# Altium schematic sheet FPGABank1X.SchDoc
size A4; SheetNumber: 6; SheetTotal: 10
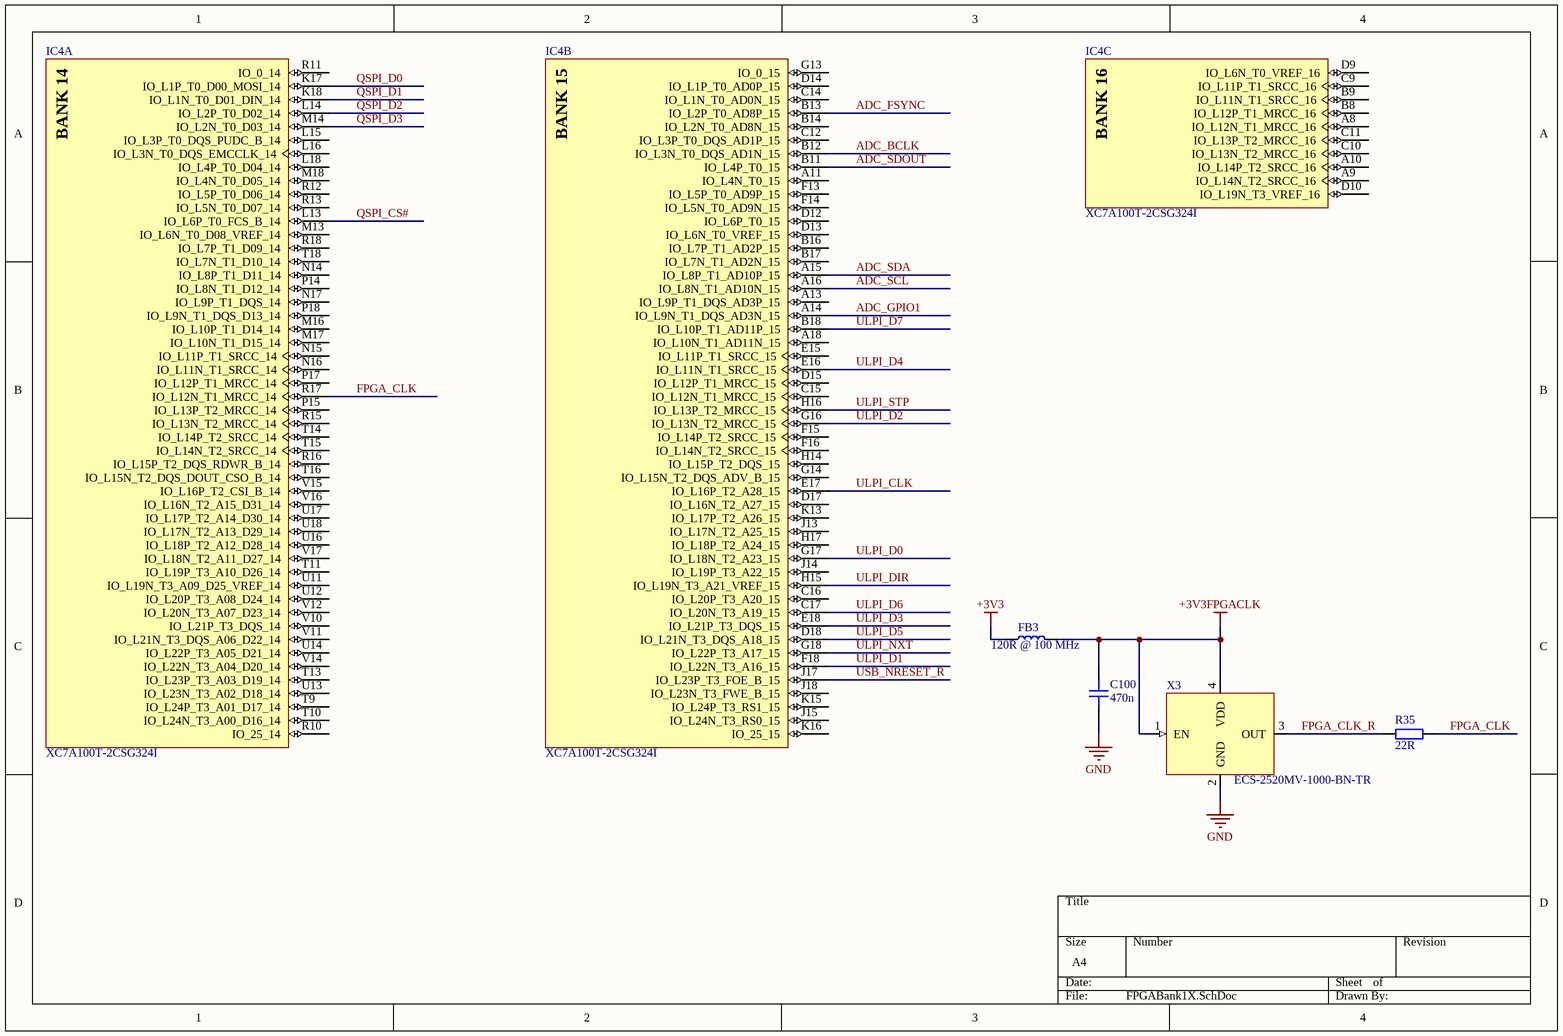
[diagram p0: FPGABank1X.SchDoc]

## Parts
C100  470n  [CAP_0201]
FB3  120R @ 100 MHz  [IND_0201]
IC4  XC7A100T-2CSG324I  [CSG324]  (parts A,B,C of 9)
R35  22R  [RES_0201]
X3  ECS-2520MV-1000-BN-TR  [XTAL_2520]

## Nets
+3V3: FB3.1
+3V3FPGACLK: C100.2 FB3.2 X3.1(EN) X3.4(VDD)
GND: C100.1 X3.2(GND)
ADC_BCLK: IC4.B12(IO_L3N_T0_DQS_AD1N_15)
ADC_FSYNC: IC4.B13(IO_L2P_T0_AD8P_15)
ADC_GPIO1: IC4.A14(IO_L9N_T1_DQS_AD3N_15)
ADC_SCL: IC4.A16(IO_L8N_T1_AD10N_15)
ADC_SDA: IC4.A15(IO_L8P_T1_AD10P_15)
ADC_SDOUT: IC4.B11(IO_L4P_T0_15)
FPGA_CLK: IC4.R17(IO_L12N_T1_MRCC_14) R35.2
FPGA_CLK_R: R35.1 X3.3(OUT)
QSPI_CS#: IC4.L13(IO_L6P_T0_FCS_B_14)
QSPI_D0: IC4.K17(IO_L1P_T0_D00_MOSI_14)
QSPI_D1: IC4.K18(IO_L1N_T0_D01_DIN_14)
QSPI_D2: IC4.L14(IO_L2P_T0_D02_14)
QSPI_D3: IC4.M14(IO_L2N_T0_D03_14)
ULPI_CLK: IC4.E17(IO_L16P_T2_A28_15)
ULPI_D0: IC4.G17(IO_L18N_T2_A23_15)
ULPI_D1: IC4.F18(IO_L22N_T3_A16_15)
ULPI_D2: IC4.G16(IO_L13N_T2_MRCC_15)
ULPI_D3: IC4.E18(IO_L21P_T3_DQS_15)
ULPI_D4: IC4.E16(IO_L11N_T1_SRCC_15)
ULPI_D5: IC4.D18(IO_L21N_T3_DQS_A18_15)
ULPI_D6: IC4.C17(IO_L20N_T3_A19_15)
ULPI_D7: IC4.B18(IO_L10P_T1_AD11P_15)
ULPI_DIR: IC4.H15(IO_L19N_T3_A21_VREF_15)
ULPI_NXT: IC4.G18(IO_L22P_T3_A17_15)
ULPI_STP: IC4.H16(IO_L13P_T2_MRCC_15)
USB_NRESET_R: IC4.J17(IO_L23P_T3_FOE_B_15)

Not connected (* = marked no-connect by the designer): IC4 A8(IO_L12N_T1_MRCC_16) A9(IO_L14N_T2_SRCC_16) A10(IO_L14P_T2_SRCC_16) A11(IO_L4N_T0_15) A13(IO_L9P_T1_DQS_AD3P_15) A18(IO_L10N_T1_AD11N_15) B8(IO_L12P_T1_MRCC_16) B9(IO_L11N_T1_SRCC_16) B14(IO_L2N_T0_AD8N_15) B16(IO_L7P_T1_AD2P_15) B17(IO_L7N_T1_AD2N_15) C9(IO_L11P_T1_SRCC_16) C10(IO_L13N_T2_MRCC_16) C11(IO_L13P_T2_MRCC_16) C12(IO_L3P_T0_DQS_AD1P_15) C14(IO_L1N_T0_AD0N_15) C15(IO_L12N_T1_MRCC_15) C16(IO_L20P_T3_A20_15) D9(IO_L6N_T0_VREF_16) D10(IO_L19N_T3_VREF_16) D12(IO_L6P_T0_15) D13(IO_L6N_T0_VREF_15) D14(IO_L1P_T0_AD0P_15) D15(IO_L12P_T1_MRCC_15) D17(IO_L16N_T2_A27_15) E15(IO_L11P_T1_SRCC_15) F13(IO_L5P_T0_AD9P_15) F14(IO_L5N_T0_AD9N_15) F15(IO_L14P_T2_SRCC_15) F16(IO_L14N_T2_SRCC_15) G13(IO_0_15) G14(IO_L15N_T2_DQS_ADV_B_15) H14(IO_L15P_T2_DQS_15) H17(IO_L18P_T2_A24_15) J13(IO_L17N_T2_A25_15) J14(IO_L19P_T3_A22_15) J15(IO_L24N_T3_RS0_15) J18(IO_L23N_T3_FWE_B_15) K13(IO_L17P_T2_A26_15) K15(IO_L24P_T3_RS1_15) K16(IO_25_15) L15(IO_L3P_T0_DQS_PUDC_B_14) L16(IO_L3N_T0_DQS_EMCCLK_14) L18(IO_L4P_T0_D04_14) M13(IO_L6N_T0_D08_VREF_14) M16(IO_L10P_T1_D14_14) M17(IO_L10N_T1_D15_14) M18(IO_L4N_T0_D05_14) N14(IO_L8P_T1_D11_14) N15(IO_L11P_T1_SRCC_14) N16(IO_L11N_T1_SRCC_14) N17(IO_L9P_T1_DQS_14) P14(IO_L8N_T1_D12_14) P15(IO_L13P_T2_MRCC_14) P17(IO_L12P_T1_MRCC_14) P18(IO_L9N_T1_DQS_D13_14) R10(IO_25_14) R11(IO_0_14) R12(IO_L5P_T0_D06_14) R13(IO_L5N_T0_D07_14) R15(IO_L13N_T2_MRCC_14) R16(IO_L15P_T2_DQS_RDWR_B_14) R18(IO_L7P_T1_D09_14) T9(IO_L24P_T3_A01_D17_14) T10(IO_L24N_T3_A00_D16_14) T11(IO_L19P_T3_A10_D26_14) T13(IO_L23P_T3_A03_D19_14) T14(IO_L14P_T2_SRCC_14) T15(IO_L14N_T2_SRCC_14) T16(IO_L15N_T2_DQS_DOUT_CSO_B_14) T18(IO_L7N_T1_D10_14) U11(IO_L19N_T3_A09_D25_VREF_14) U12(IO_L20P_T3_A08_D24_14) U13(IO_L23N_T3_A02_D18_14) U14(IO_L22P_T3_A05_D21_14) U16(IO_L18P_T2_A12_D28_14) U17(IO_L17P_T2_A14_D30_14) U18(IO_L17N_T2_A13_D29_14) V10(IO_L21P_T3_DQS_14) V11(IO_L21N_T3_DQS_A06_D22_14) V12(IO_L20N_T3_A07_D23_14) V14(IO_L22N_T3_A04_D20_14) V15(IO_L16P_T2_CSI_B_14) V16(IO_L16N_T2_A15_D31_14) V17(IO_L18N_T2_A11_D27_14)

## Notes on the sheet
- (in symbol XC7A100T-2CSG324I, part A) BANK 14
- (in symbol XC7A100T-2CSG324I, part B) BANK 15
- (in symbol XC7A100T-2CSG324I, part C) BANK 16

## Library data of the parts
C100 = CAP_0201: Capacitor SMD 0201; Manufacturer: *; Manufacturer Part Number: *; Distributor Link: *; LCSC: *; Rating: *; Dielectric: *
FB3 = IND_0201: Inductor SMD 0201; Manufacturer_Name: Murata Electronics; Manufacturer_Part_Number: LQP03HQ56NH02D; Datasheet Link: https://psearch.en.murata.com/inductor/product/LQP03HQ56NH02%23.html; Height: 0.42mm; Mouser Part Number: 81-LQP03HQ56NH02D; Mouser Price/Stock: https://www.mouser.co.uk/ProductDetail/Murata-Electronics/LQP03HQ56NH02D?qs=B6kkDfuK7%2FBQu1Ob9%2FT2Bg%3D%3D
IC4 = XC7A100T-2CSG324I: Artix-7 FPGA, 210 User I/Os, 0 GTP, 324-Ball BGA, Speed Grade 2, Industrial Grade, Pb-Free; Manufacturer: Xilinx; Logic Cells: 101440; DSP48E1 Slices: 240; Block RAM Blocks (Max Kb): 4860; Clock Mgmt Tiles (CMTs): 6; Max User I/O: 300; CLBs (Slices): 15850; Block RAM Blocks (18Kb): 270; Speed Grade: -2; Block RAM Blocks (36Kb): 135; ComponentLink1Description: Datasheet; ComponentLink3Description: DC and Switching Characteristics; Generic Part Number: XC7A100T; RoHS: Pb-Free; Mounting Technology: Surface Mount; PackageReference: CSG324; ComponentLink4URL: http://www.xilinx.com/support/packagefiles/a7packages/xc7a100tcsg324pkg.txt; NexusDeviceID: XC7A100T-2CSG324I; PackageVersion: Rev 1.8; PartNumber: XC7A100T-2CSG324I; CLBs (Max Distributed RAM Kb): 1188; Code_JEDEC: MO-275-KKAC-1; ComponentLink2Description: Package Specification; ComponentLink1URL: http://www.xilinx.com/support/documentation/data_sheets/ds180_7Series_Overview.pdf; ComponentLink3URL: http://www.xilinx.com/support/documentation/data_sheets/ds181_Artix_7_Data_Sheet.pdf; ComponentLink5URL: http://www.xilinx.com/support/documentation/user_guides/ug475_7Series_Pkg_Pinout.pdf; PackageDescription: Wire-Bond Chip-Scale BGA, Body 15 x 15 mm, 0.8 mm Pitch; ComponentLink4Description: Package File; DatasheetVersion: v1.12; ComponentLink2URL: http://www.xilinx.com/support/documentation/user_guides/ug475_7Series_Pkg_Pinout.pdf; ComponentLink5Description: Packaging and Pinout
R35 = RES_0201: Resistor SMD 0201; Manufacturer: *; Manufacturer Part Number: *; Distributor Link: *; LCSC: *
X3 = ECS-2520MV-130-BN-TR: Standard Clock Oscillators XO (Standard),13MHz,Standby (Power Down),CMOS, Multi-Volt,1.6 V 3.6 V,+/-50ppm,-40 C 85 C,6mA,Surface Mount,4-SMD, No Lead,(2.50mm x 2.00mm),(0.80mm); Manufacturer: ECS; Manufacturer Part Number: ECS-2520MV-130-BN-TR